# Altium project LEDThermometer.PrjPcb
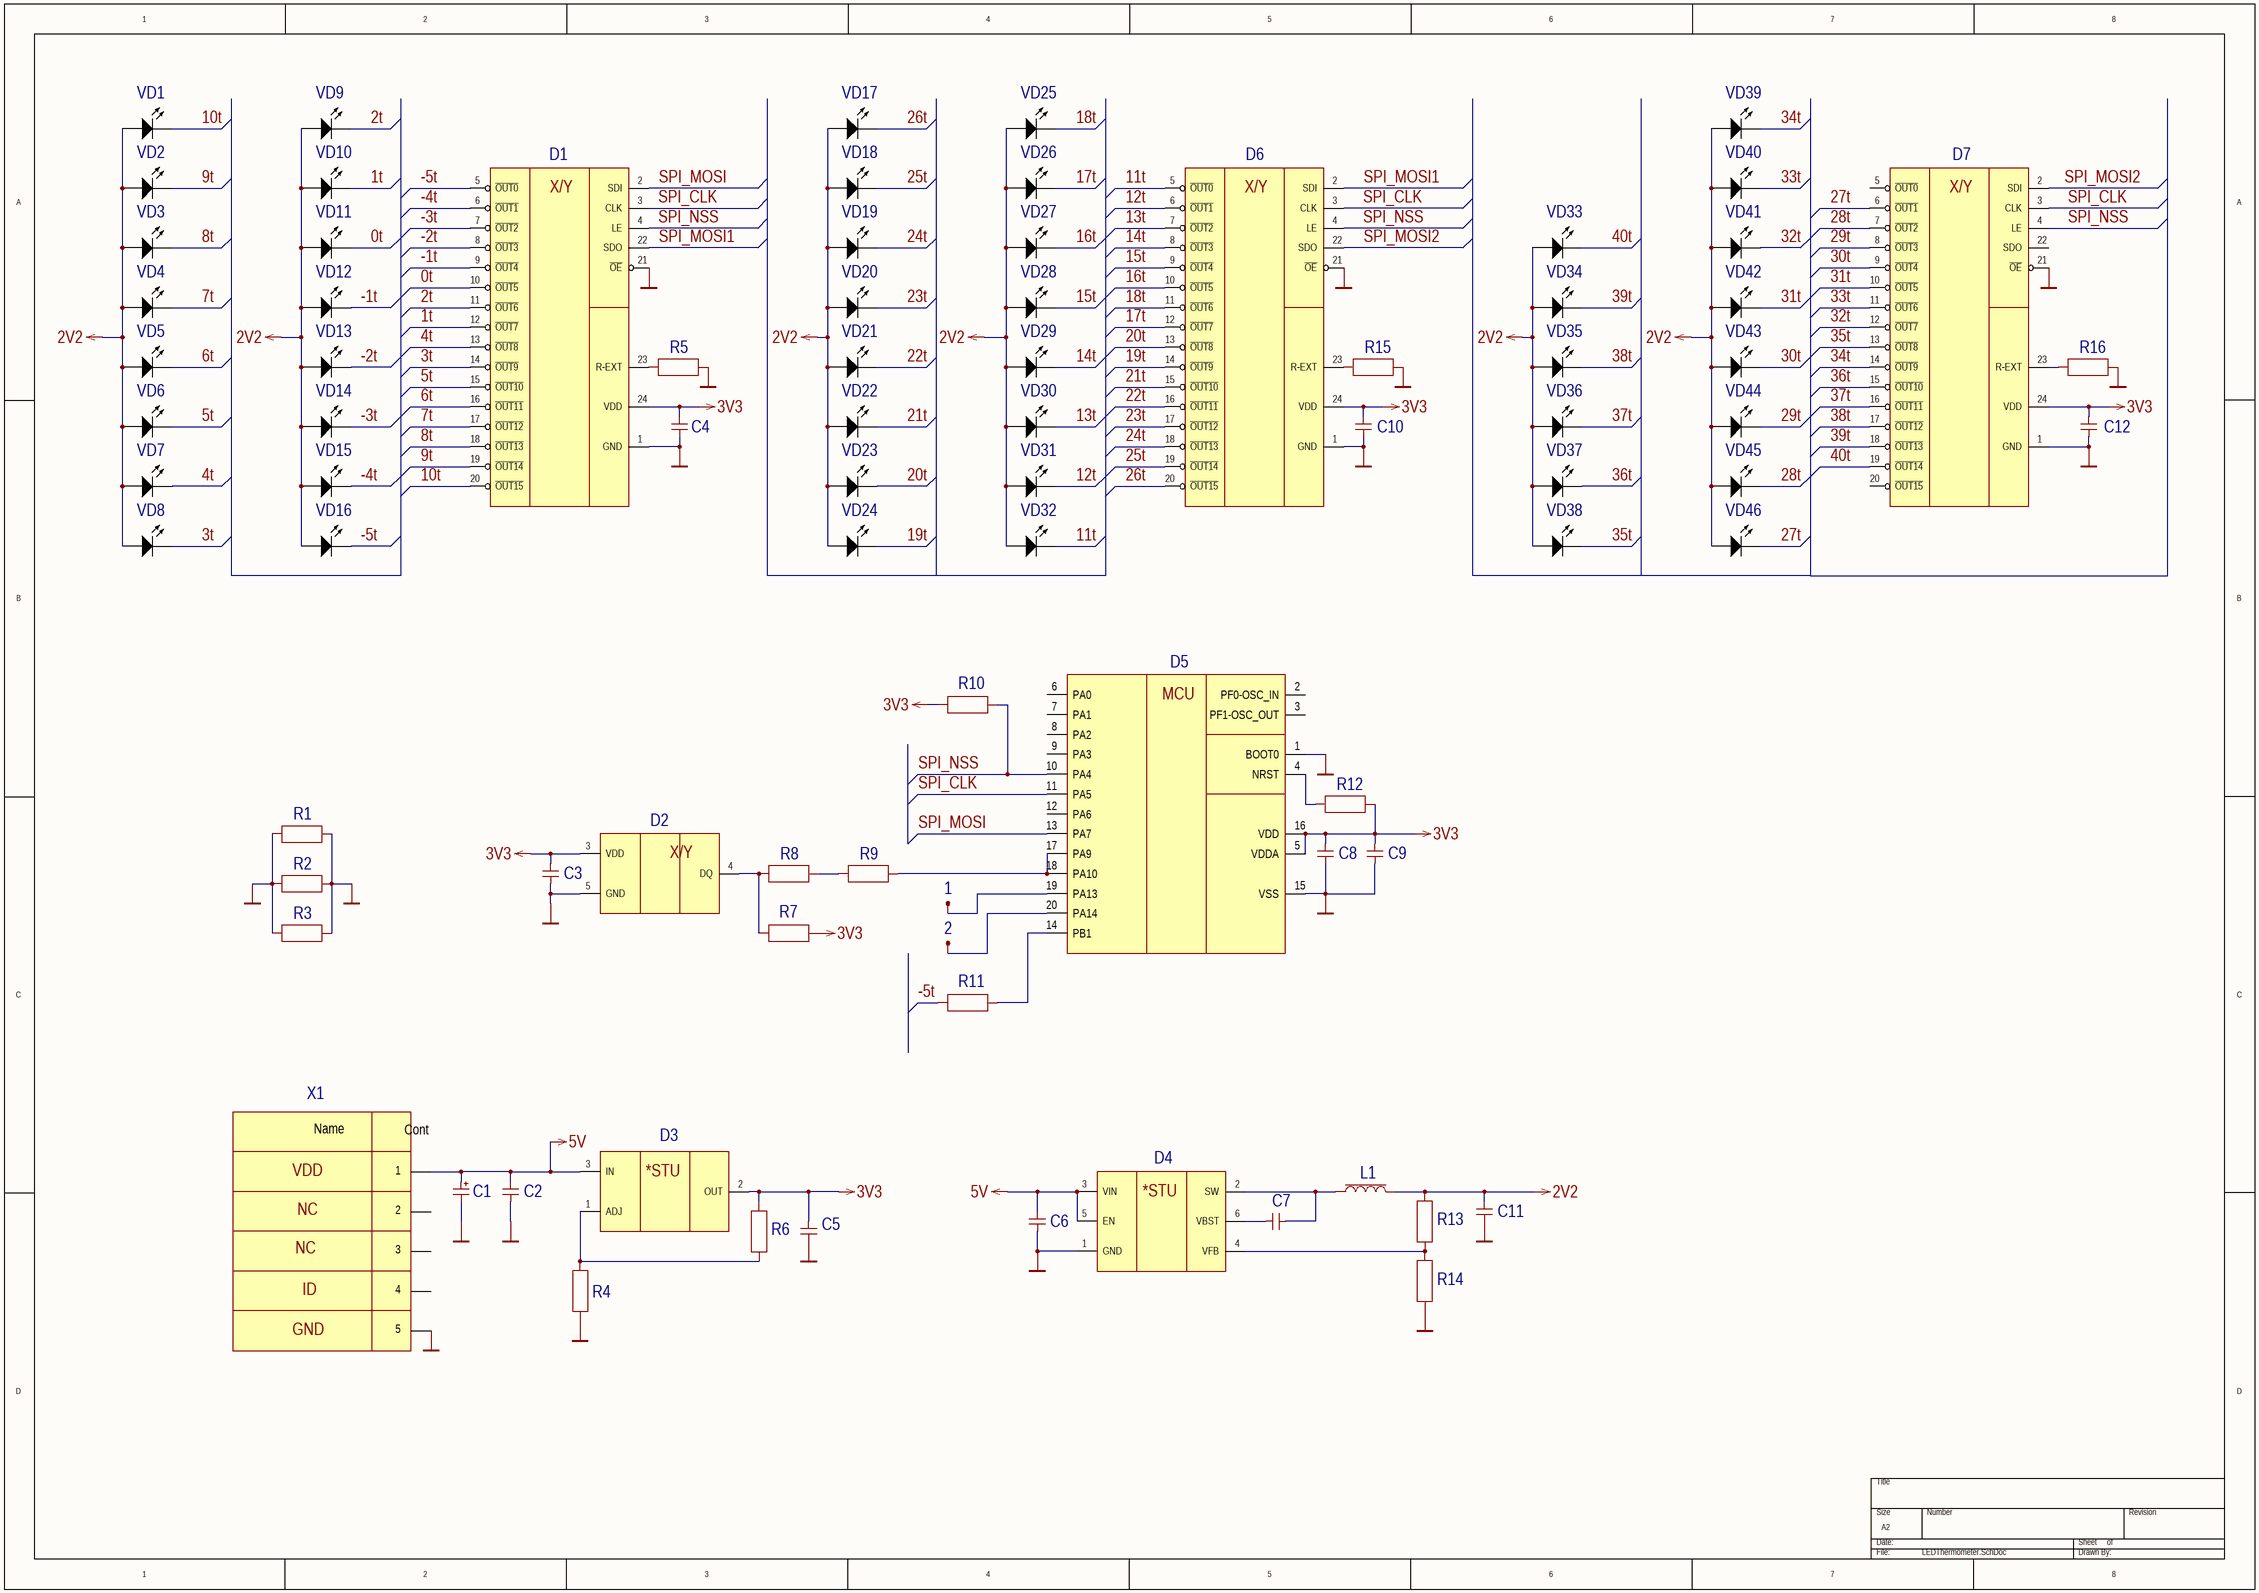
[diagram p0: LEDThermometer.SchDoc]
1 sheet, 85 parts. Net scope: global (net labels, ports and power ports of the same name join across sheets).
Board file: LEDThermometer.PcbDoc

## Sheet LEDThermometer.SchDoc: LED Thermometer
size A2; Author: JavaLandau; Address1: Address1; Address2: Address2; Address3: Address3; Address4: Address4; Revision: 1; SheetNumber: 1; SheetTotal: 1; Scale: 1:1

### Parts
1  *  [point]  (value not drawn)
2  *  [point]  (value not drawn)
C1  D-20 V-47uF±10 %  [CAP POL 2917/7343]  (value not drawn)
C2  0805-16 V-X7R-1uF±10 %  [SMD-0805C]  (value not drawn)
C3  0805-16 V-X7R-0.1uF±10 %  [SMD-0805C]  (value not drawn)
C4  0805-16 V-X7R-0.1uF±10 %  [SMD-0805C]  (value not drawn)
C5  0805-16 V-X7R-1uF±10 %  [SMD-0805C]  (value not drawn)
C6  0805-16 V-X7R-0.1uF±10 %  [SMD-0805C]  (value not drawn)
C7  0805-16 V-X7R-0.1uF±10 %  [SMD-0805C]  (value not drawn)
C8  0805-16 V-X7R-0.1uF±10 %  [SMD-0805C]  (value not drawn)
C9  0805-16 V-X7R-0.1uF±10 %  [SMD-0805C]  (value not drawn)
C10  0805-16 V-X7R-0.1uF±10 %  [SMD-0805C]  (value not drawn)
C11  1206-16 V-X7R-22uF±10 %  [SMD-1206C]  (value not drawn)
C12  0805-16 V-X7R-0.1uF±10 %  [SMD-0805C]  (value not drawn)
D1  MBI5039GF-B  [SOP24L]  (value not drawn)
D2  DS18B20Z+  [SO8_M]  (value not drawn)
D3  LM317DCYR  [SOT223_M]  (value not drawn)
D4  TPS562200DDCT  [SOT23-6_M]  (value not drawn)
D5  STM32F030F4P6  [TSSOP-20]  (value not drawn)
D6  MBI5039GF-B  [SOP24L]  (value not drawn)
D7  MBI5039GF-B  [SOP24L]  (value not drawn)
L1  NLCV32T-2R2M-EF  [1210_M]  (value not drawn)
R1  0805±5 %-0 Ohm  [SMD-0805-RES]  (value not drawn)
R2  0805±5 %-0 Ohm  [SMD-0805-RES]  (value not drawn)
R3  0805±5 %-0 Ohm  [SMD-0805-RES]  (value not drawn)
R4  0805±1 %-2 kOhm  [SMD-0805-RES]  (value not drawn)
R5  0805±1 %-10 kOhm  [SMD-0805-RES]  (value not drawn)
R6  0805±1 %-1.3 kOhm  [SMD-0805-RES]  (value not drawn)
R7  0805±5 %-4.7 kOhm  [SMD-0805-RES]  (value not drawn)
R8  0805±5 %-0 Ohm  [SMD-0805-RES]  (value not drawn)
R9  0805±5 %-0 Ohm  [SMD-0805-RES]  (value not drawn)
R10  0805±5 %-10 kOhm  [SMD-0805-RES]  (value not drawn)
R11  DNP  [SMD-0805-RES]  (value not drawn)
R12  0805±5 %-10 kOhm  [SMD-0805-RES]  (value not drawn)
R13  0805±1 %-19.6 kOhm  [SMD-0805-RES]  (value not drawn)
R14  0805±1 %-10.2 kOhm  [SMD-0805-RES]  (value not drawn)
R15  0805±1 %-10 kOhm  [SMD-0805-RES]  (value not drawn)
R16  0805±1 %-10 kOhm  [SMD-0805-RES]  (value not drawn)
VD1  L-144IDT  [LED_1.9x3.9mm]  (value not drawn)
VD2  L-144IDT  [LED_1.9x3.9mm]  (value not drawn)
VD3  L-144IDT  [LED_1.9x3.9mm]  (value not drawn)
VD4  L-144IDT  [LED_1.9x3.9mm]  (value not drawn)
VD5  L-144IDT  [LED_1.9x3.9mm]  (value not drawn)
VD6  L-144IDT  [LED_1.9x3.9mm]  (value not drawn)
VD7  L-144IDT  [LED_1.9x3.9mm]  (value not drawn)
VD8  L-144IDT  [LED_1.9x3.9mm]  (value not drawn)
VD9  L-144IDT  [LED_1.9x3.9mm]  (value not drawn)
VD10  L-144IDT  [LED_1.9x3.9mm]  (value not drawn)
VD11  L-144IDT  [LED_1.9x3.9mm]  (value not drawn)
VD12  L-144IDT  [LED_1.9x3.9mm]  (value not drawn)
VD13  L-144IDT  [LED_1.9x3.9mm]  (value not drawn)
VD14  L-144IDT  [LED_1.9x3.9mm]  (value not drawn)
VD15  L-144IDT  [LED_1.9x3.9mm]  (value not drawn)
VD16  L-793ID  [LED_8mm]  (value not drawn)
VD17  L-144IDT  [LED_1.9x3.9mm]  (value not drawn)
VD18  L-144IDT  [LED_1.9x3.9mm]  (value not drawn)
VD19  L-144IDT  [LED_1.9x3.9mm]  (value not drawn)
VD20  L-144IDT  [LED_1.9x3.9mm]  (value not drawn)
VD21  L-144IDT  [LED_1.9x3.9mm]  (value not drawn)
VD22  L-144IDT  [LED_1.9x3.9mm]  (value not drawn)
VD23  L-144IDT  [LED_1.9x3.9mm]  (value not drawn)
VD24  L-144IDT  [LED_1.9x3.9mm]  (value not drawn)
VD25  L-144IDT  [LED_1.9x3.9mm]  (value not drawn)
VD26  L-144IDT  [LED_1.9x3.9mm]  (value not drawn)
VD27  L-144IDT  [LED_1.9x3.9mm]  (value not drawn)
VD28  L-144IDT  [LED_1.9x3.9mm]  (value not drawn)
VD29  L-144IDT  [LED_1.9x3.9mm]  (value not drawn)
VD30  L-144IDT  [LED_1.9x3.9mm]  (value not drawn)
VD31  L-144IDT  [LED_1.9x3.9mm]  (value not drawn)
VD32  L-144IDT  [LED_1.9x3.9mm]  (value not drawn)
VD33  L-144IDT  [LED_1.9x3.9mm]  (value not drawn)
VD34  L-144IDT  [LED_1.9x3.9mm]  (value not drawn)
VD35  L-144IDT  [LED_1.9x3.9mm]  (value not drawn)
VD36  L-144IDT  [LED_1.9x3.9mm]  (value not drawn)
VD37  L-144IDT  [LED_1.9x3.9mm]  (value not drawn)
VD38  L-144IDT  [LED_1.9x3.9mm]  (value not drawn)
VD39  L-144IDT  [LED_1.9x3.9mm]  (value not drawn)
VD40  L-144IDT  [LED_1.9x3.9mm]  (value not drawn)
VD41  L-144IDT  [LED_1.9x3.9mm]  (value not drawn)
VD42  L-144IDT  [LED_1.9x3.9mm]  (value not drawn)
VD43  L-144IDT  [LED_1.9x3.9mm]  (value not drawn)
VD44  L-144IDT  [LED_1.9x3.9mm]  (value not drawn)
VD45  L-144IDT  [LED_1.9x3.9mm]  (value not drawn)
VD46  L-144IDT  [LED_1.9x3.9mm]  (value not drawn)
X1  DS1104-B60SRS  [Mini-USB-B]  (value not drawn)

### Nets
2V2: C11.2 L1.2 R13.2 VD1.1(A) VD2.1(A) VD3.1(A) VD4.1(A) VD5.1(A) VD6.1(A) VD7.1(A) VD8.1(A) VD9.1(A) VD10.1(A) VD11.1(A) VD12.1(A) VD13.1(A) VD14.1(A) VD15.1(A) VD16.1(A) VD17.1(A) VD18.1(A) VD19.1(A) VD20.1(A) VD21.1(A) VD22.1(A) VD23.1(A) VD24.1(A) VD25.1(A) VD26.1(A) VD27.1(A) VD28.1(A) VD29.1(A) VD30.1(A) VD31.1(A) VD32.1(A) VD33.1(A) VD34.1(A) VD35.1(A) VD36.1(A) VD37.1(A) VD38.1(A) VD39.1(A) VD40.1(A) VD41.1(A) VD42.1(A) VD43.1(A) VD44.1(A) VD45.1(A) VD46.1(A)
3V3: C3.2 C4.2 C5.2 C8.2 C9.2 C10.2 C12.2 D1.24(VDD) D2.3(VDD) D3.2(OUT) D5.5(VDDA) D5.16(VDD) D6.24(VDD) D7.24(VDD) R6.2 R7.1 R10.1 R12.2
5V: C1.1 C2.2 C6.2 D3.3(IN) D4.3(VIN) D4.5(EN) X1.1
GND: C1.2 C2.1 C3.1 C4.1 C5.1 C6.1 C8.1 C9.1 C10.1 C11.1 C12.1 D1.1(GND) D1.21(~{OE}) D2.5(GND) D4.1(GND) D5.1(BOOT0) D5.15(VSS) D6.1(GND) D6.21(~{OE}) D7.1(GND) D7.21(~{OE}) R1.1 R1.2 R2.1 R2.2 R3.1 R3.2 R4.2 R5.2 R14.1 R15.2 R16.2 X1.5
0t: D1.10(~{OUT5}) VD11.2(K)
1t: D1.12(~{OUT7}) VD10.2(K)
2t: D1.11(~{OUT6}) VD9.2(K)
3t: D1.14(~{OUT9}) VD8.2(K)
4t: D1.13(~{OUT8}) VD7.2(K)
5t: D1.15(~{OUT10}) VD6.2(K)
6t: D1.16(~{OUT11}) VD5.2(K)
7t: D1.17(~{OUT12}) VD4.2(K)
8t: D1.18(~{OUT13}) VD3.2(K)
9t: D1.19(~{OUT14}) VD2.2(K)
10t: D1.20(~{OUT15}) VD1.2(K)
11t: D6.5(~{OUT0}) VD32.2(K)
12t: D6.6(~{OUT1}) VD31.2(K)
13t: D6.7(~{OUT2}) VD30.2(K)
14t: D6.8(~{OUT3}) VD29.2(K)
15t: D6.9(~{OUT4}) VD28.2(K)
16t: D6.10(~{OUT5}) VD27.2(K)
17t: D6.12(~{OUT7}) VD26.2(K)
18t: D6.11(~{OUT6}) VD25.2(K)
19t: D6.14(~{OUT9}) VD24.2(K)
20t: D6.13(~{OUT8}) VD23.2(K)
21t: D6.15(~{OUT10}) VD22.2(K)
22t: D6.16(~{OUT11}) VD21.2(K)
23t: D6.17(~{OUT12}) VD20.2(K)
24t: D6.18(~{OUT13}) VD19.2(K)
25t: D6.19(~{OUT14}) VD18.2(K)
26t: D6.20(~{OUT15}) VD17.2(K)
27t: D7.6(~{OUT1}) VD46.2(K)
28t: D7.7(~{OUT2}) VD45.2(K)
29t: D7.8(~{OUT3}) VD44.2(K)
30t: D7.9(~{OUT4}) VD43.2(K)
31t: D7.10(~{OUT5}) VD42.2(K)
32t: D7.12(~{OUT7}) VD41.2(K)
33t: D7.11(~{OUT6}) VD40.2(K)
34t: D7.14(~{OUT9}) VD39.2(K)
35t: D7.13(~{OUT8}) VD38.2(K)
36t: D7.15(~{OUT10}) VD37.2(K)
37t: D7.16(~{OUT11}) VD36.2(K)
38t: D7.17(~{OUT12}) VD35.2(K)
39t: D7.18(~{OUT13}) VD34.2(K)
40t: D7.19(~{OUT14}) VD33.2(K)
-1t: D1.9(~{OUT4}) VD12.2(K)
-2t: D1.8(~{OUT3}) VD13.2(K)
-3t: D1.7(~{OUT2}) VD14.2(K)
-4t: D1.6(~{OUT1}) VD15.2(K)
-5t: D1.5(~{OUT0}) R11.1 VD16.2(K)
SPI_CLK: D1.3(CLK) D5.11(PA5) D6.3(CLK) D7.3(CLK)
SPI_MOSI: D1.2(SDI) D5.13(PA7)
SPI_MOSI1: D1.22(SDO) D6.2(SDI)
SPI_MOSI2: D6.22(SDO) D7.2(SDI)
SPI_NSS: D1.4(LE) D5.10(PA4) D6.4(LE) D7.4(LE) R10.2
Net1_1: 1.1 D5.19(PA13)
Net2_1: 2.1 D5.20(PA14)
NetC7_1: C7.1 D4.2(SW) L1.1
NetC7_2: C7.2 D4.6(VBST)
NetD1_23: D1.23(R-EXT) R5.1
NetD2_4: D2.4(DQ) R7.2 R8.1
NetD3_1: D3.1(ADJ) R4.1 R6.1
NetD4_4: D4.4(VFB) R13.1 R14.2
NetD5_4: D5.4(NRST) R12.1
NetD5_14: D5.14(PB1) R11.2
NetD5_17: D5.17(PA9) D5.18(PA10) R9.2
NetD6_23: D6.23(R-EXT) R15.1
NetD7_23: D7.23(R-EXT) R16.1
NetR8_2: R8.2 R9.1

Not connected (* = marked no-connect by the designer): D5 2(PF0-OSC_IN) 3(PF1-OSC_OUT) 6(PA0) 7(PA1) 8(PA2) 9(PA3) 12(PA6); D7 5(~{OUT0}) 20(~{OUT15}) 22(SDO); X1 2 3 4

### Notes on the sheet
- VDD
- NC
- ID
- GND
- Title
- Size:
- Date:
- File:
- A2
- Number:
- Time:
- Revision:
- Sheet
- of
- (in symbol DS18B20) X/Y
- (in symbol LM317) *STU
- (in symbol MBI5039) X/Y
- (in symbol MINI-USB-B) Name; Cont
- (in symbol STM32F030F) MCU
- (in symbol TPS562200) *STU

### Library data of the parts
1 2 = Point
C1 = Cap_el: Electrolytic capacitor; Value: 47 uF; Manufacturer: *; ComponentLink1Description: Datasheet
C2 C5 = Cap: Capacitor; Value: 1 uF; Manufacturer: *; ComponentLink1Description: Datasheet
C3 C4 C6-C10 C12 = Cap: Capacitor; Value: 0.1 uF; Manufacturer: *; ComponentLink1Description: Datasheet
C11 = Cap: Capacitor; Value: 22 uF; Manufacturer: *; ComponentLink1Description: Datasheet
D1 D6 D7 = MBI5039: 16-Channel Constant Current LED Sink Driver with Silent Error Detection and Current Gain; Manufacturer: Macroblock; ComponentLink1Description: Datasheet; ComponentLink1URL: http://www.sddz-ic.com/en/upload/2009321152554277566SA6V.pdf
D2 = DS18B20: Programmable Resolution 1-Wire Digital Thermometer; Manufacturer: Maxim Integrated; ComponentLink1Description: Datasheet; ComponentLink1URL: https://datasheets.maximintegrated.com/en/ds/DS18B20.pdf
D3 = LM317: 3-Terminal Adjustable Regulator; Manufacturer: Texas Instruments; ComponentLink1Description: Datasheet; ComponentLink1URL: http://www.ti.com/lit/ds/symlink/lm317.pdf
D4 = TPS562200: 4.5-V To 17-V Input, 2-A, 3-A Synchronous Step-Down Voltage Regulator; Manufacturer: Texas Instruments; ComponentLink1Description: Datasheet; ComponentLink1URL: http://www.ti.com/lit/ds/symlink/tps562200.pdf
D5 = STM32F030F: Value-line ARM®-based 32-bit MCU with up to 256-KB Flash,   timers, ADC, communication interfaces, 2.4-3.6 V operation; Manufacturer: STMicroelectronics; ComponentLink1Description: Datasheet; ComponentLink1URL: http://www.st.com/content/ccc/resource/technical/document/datasheet/a4/5d/0b/0e/87/c4/4d/71/DM00088500.pdf/files/DM00088500.pdf/jcr:content/translations/en.DM00088500.pdf
L1 = Inductor: Manufacturer: TDK; Value: 2.2 uH; ComponentLink1Description: Datasheet; ComponentLink1URL: https://product.tdk.com/info/en/catalog/datasheets/inductor_commercial_decoupling_nlcv32-ef_en.pdf
R1-R3 R8 R9 = Res: Resistor; Value: 0 Ohm; Manufacturer: *; ComponentLink1Description: Datasheet
R4 = Res: Resistor; Value: 2 kOhm; Manufacturer: *; ComponentLink1Description: Datasheet
R5 R10 R12 R15 R16 = Res: Resistor; Value: 10 kOhm; Manufacturer: *; ComponentLink1Description: Datasheet
R6 R7 R11 R13 R14 = Res: Resistor; Manufacturer: *; ComponentLink1Description: Datasheet
  R6: Value: 1.3 kOhm
  R7: Value: 4.7 kOhm
  R11: Value: DNP
  R13: Value: 19.6 kOhm
  R14: Value: 10.2 kOhm
VD1-VD46 = LED: Typical INFRARED GaAs LED; Manufacturer: Kingbright; ComponentLink1Description: Datasheet
  VD1-VD15 VD17-VD46: ComponentLink1URL: http://www.kingbright.com/attachments/file/psearch/000/00/00/L-144IDT(Ver.13A).pdf
  VD16: ComponentLink1URL: http://www.kingbright.com/attachments/file/psearch/000/00/00/L-793ID(Ver.10A).pdf
X1 = MINI-USB-B: Mini USB-B connector; Manufacturer: Connfly Electronics; ComponentLink1Description: Datasheet; ComponentLink1URL: https://lib.chipdip.ru/497/DOC001497231.pdf